# EAGLE design eggfckr (EAGLE 7.1.0)
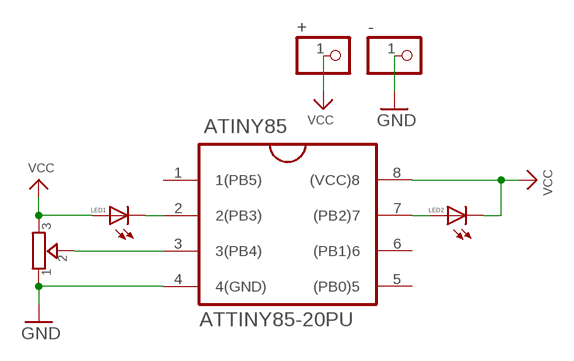
[diagram p0: schematic, sheet 1]

## Parts
+  HEADER-1X1  [1X01_OVAL]
-  HEADER-1X1  [1X01_OVAL]
ATINY85  ATTINY85-20PU  [DIP254P762X533-8]
LED1  LED3MM  [LED3MM]
LED2  LED3MM  [LED3MM]
R3  TRIMMER-3306F  [TRIMMER_3306F]

## Nets
GND: -.1 ATINY85.4(4(GND)) R3.1
N$1: ATINY85.7((PB2)7) LED2.A
N$2: ATINY85.3(3(PB4)) R3.2
N$3: ATINY85.2(2(PB3)) LED1.K(C)
VCC: +.1 ATINY85.8((VCC)8) LED1.A LED2.K(C) R3.3
Unconnected: ATINY85.1(1(PB5)) ATINY85.5((PB0)5) ATINY85.6((PB1)6)

## Library data of the parts
+ - = eggfckr:HEADER-1X1: PIN HEADER
ATINY85 = eggfckr:ATTINY85-20PU: 8-bit Microcontroller with In-System Programmable Flash; MPN: ATTINY85-20PU; OC_FARNELL: 1455162; OC_NEWARK: 58M3796; PACKAGE: PDIP-8; SUPPLIER: Atmel
LED1 LED2 = adafruit:LED: LED OSRAM: - CHIPLED LG R971, LG N971, LY N971, LG Q971, LY Q971, LO R971, LY R971 LH N974, LH R974 LS Q976, LO Q976, LY Q976 LO Q996 - Hyper CHIPLED LW Q18S LB Q993, LB Q99A, LB R99A - SideLED LS A670, LO A670, LY A670, LG A670, LP A670 LB A673, LV A673, LT A673, LW A673 LH A674 LY A675 LS A676, LA A676, LO A676, LY A676, LW A676 LS A679, LY A679, LG A679 - Hyper Micro SIDELED® LS Y876, LA Y876, LO Y876, LY Y876 LT Y87S - SmartLED LW L88C, LW L88S LB L89C, LB L89S, LG L890 LS L89K, LO L89K, LY L89K LS L896, LA L896, LO L896, LY L896 - TOPLED LS T670, LO T670, LY T670, LG T670, LP T670 LSG T670, LSP T670, LSY T670, LOP T670, LYG T670 LG T671, LOG T671, LSG T671 LB T673, LV T673, LT T673, LW T673 LH T674 LS T676, LA T676, LO T676, LY T676, LB T676, LH T676, LSB T676, LW T676 LB T67C, LV T67C, LT T67C, LS T67K, LO T67K, LY T67K, LW E67C LS E67B, LA E67B, LO E67B, LY E67B, LB E67C, LV E67C, LT E67C LW T67C LS T679, LY T679, LG T679 LS T770, LO T770, LY T770, LG T770, LP T770 LB T773, LV T773, LT T773, LW T773 LH T774 LS E675, LA E675, LY E675, LS T675 LS T776, LA T776, LO T776, LY T776, LB T776 LHGB T686 LT T68C, LB T68C - Hyper Mini TOPLED® LB M676 - Mini TOPLED Santana® LG M470 LS M47K, LO M47K, LY M47K Source: http://www.osram.convergy.de/
R3 = eggfckr:TRIMMER: Trimmer resistor

## Board
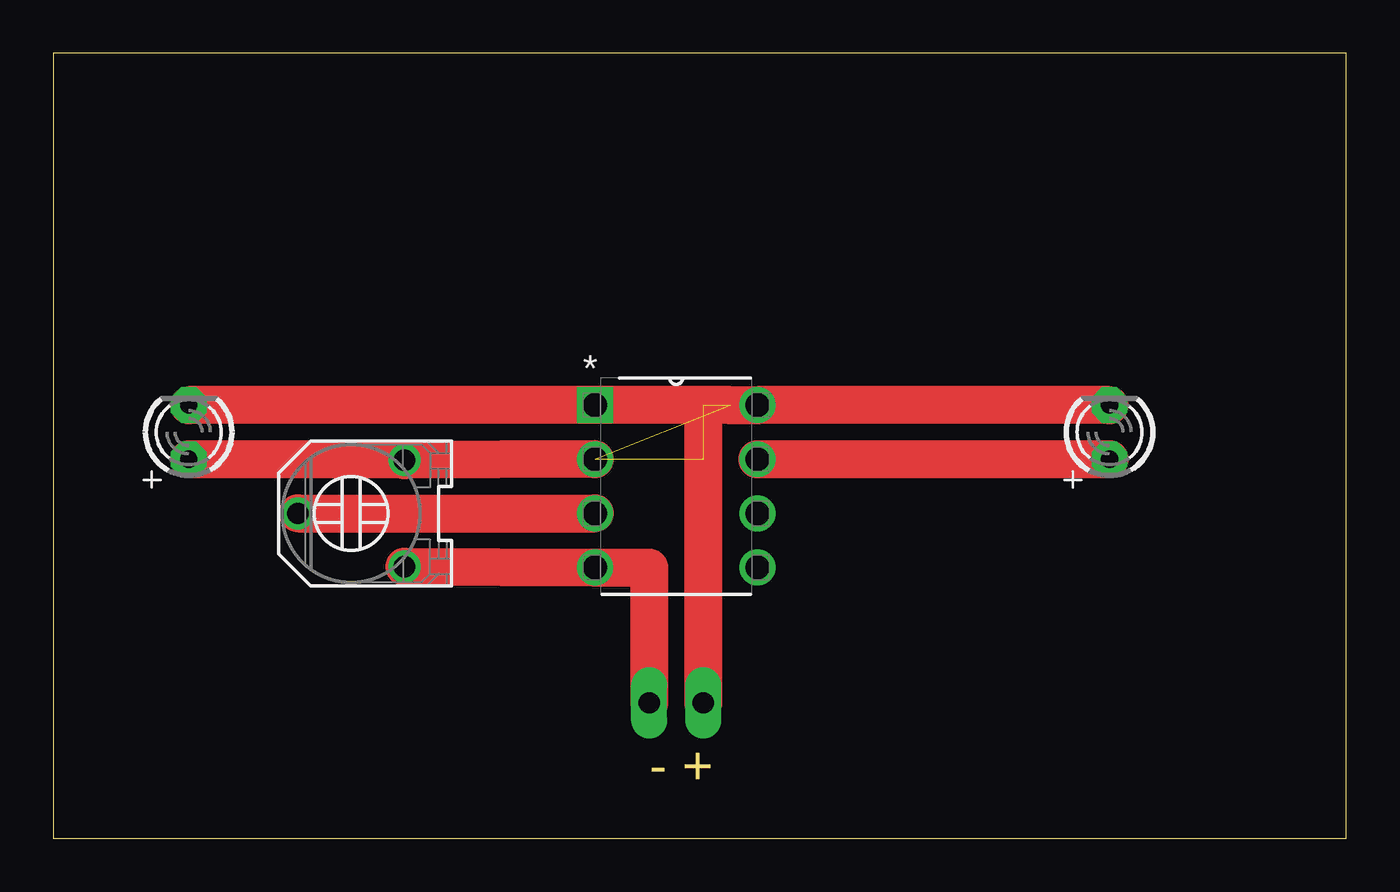
[diagram p1: board, top side]

Size 60.63 x 36.82 mm. Coordinates in mm from the lower left corner, seen from the top.
Outline: 0,0 60.63,0 60.63,36.82 0,36.82 0,0
Copper layers (1*16): Top 0.035mm / dielectric 1.5mm / Bottom 0.035mm
Design rules "default": minimum track width 10mil, minimum drill 24mil, track to track 8mil, track to pad 8mil, pad to pad 8mil, via to via 8mil, smd to smd 8mil, copper to edge 40mil, drill to drill 8mil, minimum pad ring 10mil, minimum via ring 8mil, stop-mask expansion 4mil, vias tented up to drill 0mil, thermal gap 10mil

### Footprints (pad centres in the part's own frame; a part is rotated, then mirrored left to right if it is on the bottom)
1X01_OVAL = drill 1 pad 1.676 long: 1 0,0
DIP254P762X533-8 = drill 1.118 square: 1 -7.62,7.62 | drill 1.118: 2 -7.62,5.08; 3 -7.62,2.54; 4 -7.62,0; 5 0,0; 6 0,2.54; 7 0,5.08; 8 0,7.62
LED3MM = drill 0.813 pad 1.676 octagon: A -1.27,0; K 1.27,0
TRIMMER_3306F = drill 1: 1 -2.5,-2.5; 2 0,2.5; 3 2.5,-2.5

### Placement (x,y rotation side)
+  30.48,6.35 0 top
-  27.94,6.35 0 top
ATINY85  33.02,12.7 0 top
LED1  6.35,19.05 90 top
LED2  49.53,19.05 90 top
R3  13.97,15.24 90 top

### Tracks (layer width: path | path; a pad name or v marks a point on that pad's centre or on a via)
GND
  Top 1.778: R3.1 ATINY85.4 27.94,12.7 -.1
N$1
  Top 1.778: ATINY85.7 LED2.A
N$2
  Top 1.778: R3.2 ATINY85.3
N$3  (1 unrouted)
  Top 1.778: 31.75,20.32 LED1.K
VCC  (3 unrouted)
  Top 0.406: 16.51,17.78 R3.3
  Top 1.778: LED2.K ATINY85.8 31.75,20.32 | +.1 30.48,20.32 | 25.4,17.78 R3.3 | LED1.A 16.51,17.78

### Text on the board
Dimension: - +